# EAGLE design AltimeterFio (EAGLE 9.6.2)

## Sheet 1 of 2
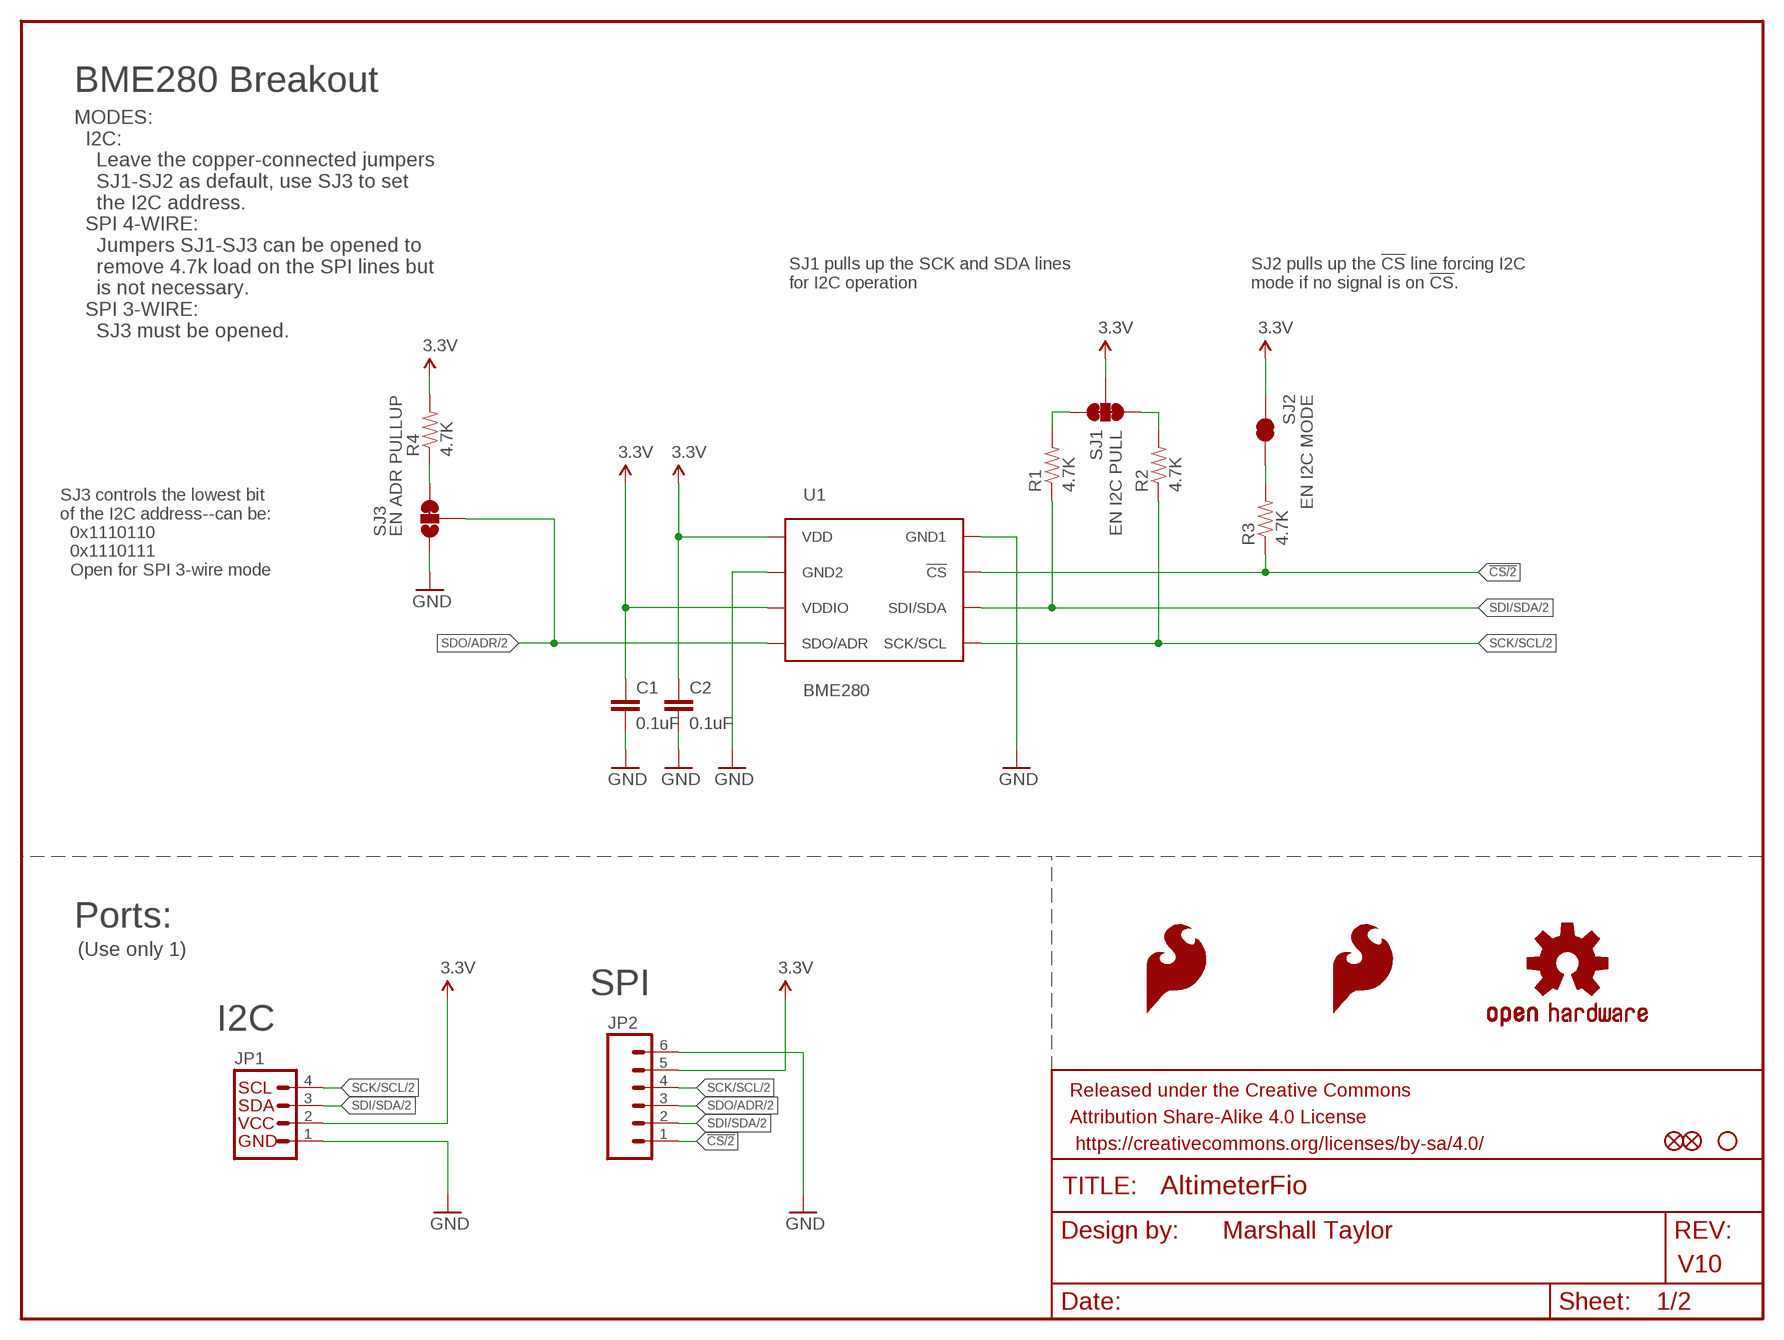
[diagram p0: schematic, sheet 1]

### Parts
C1  0.1uF  0.1UF-25V-5%(0603)  [0603-CAP]
C2  0.1uF  0.1UF-25V-5%(0603)  [0603-CAP]
FID1  FIDUCIAL1X2  [FIDUCIAL-1X2]
FID2  FIDUCIAL1X2  [FIDUCIAL-1X2]
FRAME1  FRAME-LETTER  [CREATIVE_COMMONS]
JP1  I2C_STANDARD_NO_SILK  [1X04_NO_SILK]
JP2  M06NO_SILK_FEMALE_PTH  [1X06_NO_SILK]
LOGO1  SFE_LOGO_FLAME.1_INCH  [SFE_LOGO_FLAME_.1]
LOGO2  SFE_LOGO_FLAME.1_INCH  [SFE_LOGO_FLAME_.1]
LOGO3  OSHW-LOGOS  [OSHW-LOGO-S]
R1  4.7K  4.7KOHM-1/10W-1%(0603)  [0603-RES]
R2  4.7K  4.7KOHM-1/10W-1%(0603)  [0603-RES]
R3  4.7K  4.7KOHM-1/10W-1%(0603)  [0603-RES]
R4  4.7K  4.7KOHM-1/10W-1%(0603)  [0603-RES]
SJ1  EN I2C PULL  JUMPER-PAD-3-NC_BY_TRACE  [PAD-JUMPER-3-3OF3_NC_BY_TRACE_YES_SILK_FULL_BOX]
SJ2  EN I2C MODE  JUMPER-PAD-2-NC_BY_TRACE  [PAD-JUMPER-2-NC_BY_TRACE_YES_SILK]
SJ3  EN ADR PULLUP  JUMPER-PAD-3-2OF3_NC_BY_TRACE_SMALL  [PAD-JUMPER-3-2OF3_NC_BY_TRACE_YES_SILK_FULL_BOX]
STANDOFF4  STAND-OFF  [STAND-OFF]
U1  BME280  [BME280_LGA]

### Nets
3.3V: C1.1 C2.1 JP1.2 JP2.5 R4.2 SJ1.2 SJ2.2 U1.P$6(VDDIO) U1.P$8(VDD) ; also sheet 2
!CS: JP2.1 R3.1 U1.P$2(!CS) ; also sheet 2
GND: C1.2 C2.2 JP1.1 JP2.6 SJ3.1 U1.P$1(GND1) U1.P$7(GND2) ; also sheet 2
N$1: R1.2 SJ1.3
N$2: R2.2 SJ1.1
N$3: R3.2 SJ2.1
N$4: R4.1 SJ3.3
SCK/SCL: JP1.4 JP2.4 R2.1 U1.P$4(SCK/SCL) ; also sheet 2
SDI/SDA: JP1.3 JP2.2 R1.1 U1.P$3(SDI/SDA) ; also sheet 2
SDO/ADR: JP2.3 SJ3.2 U1.P$5(SDO/ADR) ; also sheet 2

### Notes on the sheet
- BME280 Breakout
- MODES:
    I2C:
      Leave the copper-connected jumpers
      SJ1-SJ2 as default, use SJ3 to set
      the I2C address.
    SPI 4-WIRE:
      Jumpers SJ1-SJ3 can be opened to 
      remove 4.7k load on the SPI lines but
      is not necessary.
    SPI 3-WIRE:
      SJ3 must be opened.
- SJ1 pulls up the SCK and SDA lines
  for I2C operation
- SJ2 pulls up the !CS! line forcing I2C
  mode if no signal is on !CS!.
- SJ3 controls the lowest bit
  of the I2C address--can be:
    0x1110110
    0x1110111
    Open for SPI 3-wire mode
- Ports:
- (Use only 1)
- SPI
- I2C
- Marshall Taylor
- V10

## Sheet 2 of 2
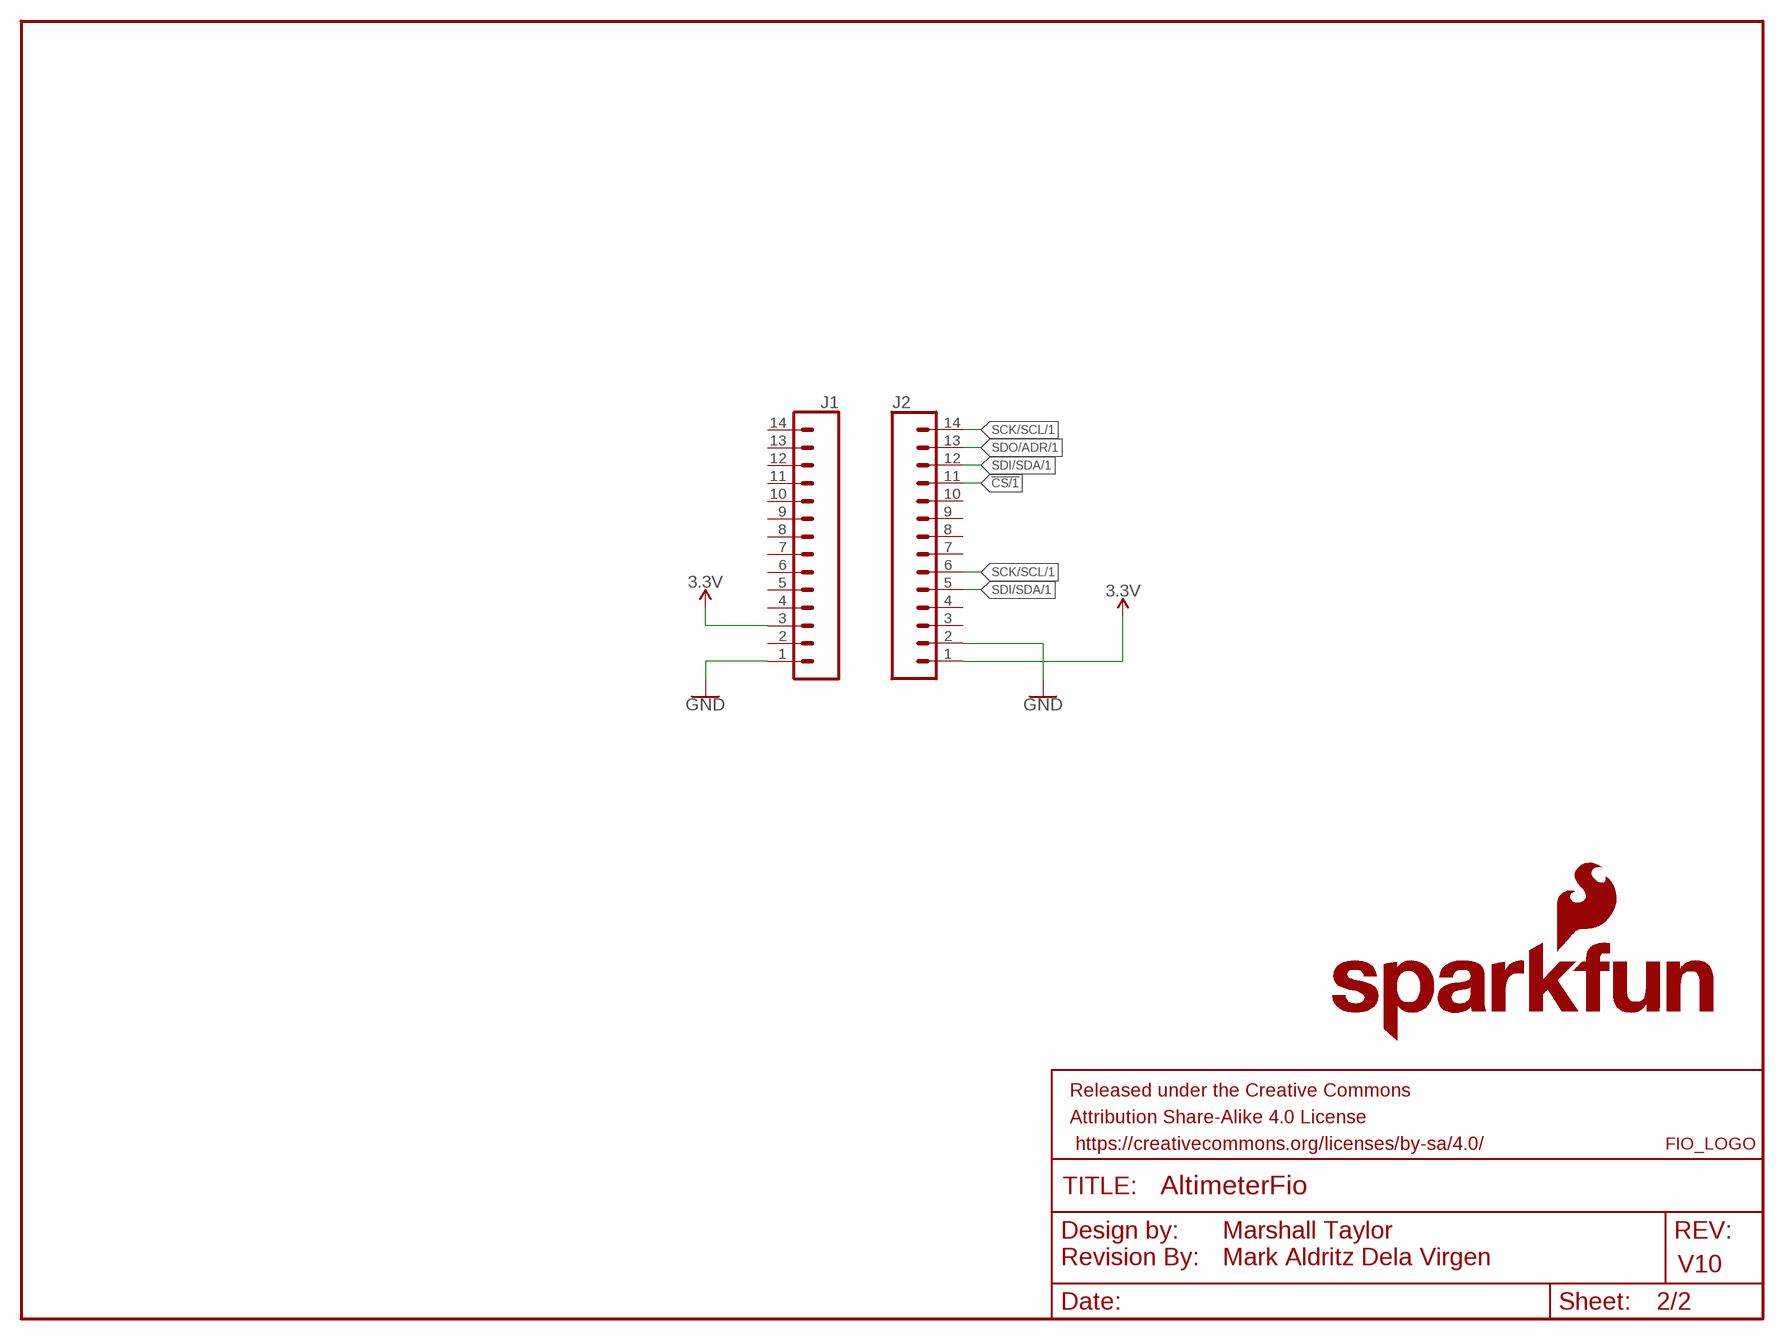
[diagram p1: schematic, sheet 2]

### Parts
FRAME2  FRAME-LETTERNO_PACKAGE  [DUMMY]
J1  CONN_14  [1X14]
J2  CONN_14  [1X14]
LOGO4  FIO_LOGOV2  [FIO_LOGO]
LOGO5  REVISION  [REVISION]
LOGO6  SFE_LOGO_NAME_FLAME.1_INCH  [SFE_LOGO_NAME_FLAME_.1]

### Nets
3.3V: J1.3 J2.1 ; also sheet 1
!CS: J2.11 ; also sheet 1
GND: J1.1 J2.2 ; also sheet 1
SCK/SCL: J2.6 J2.14 ; also sheet 1
SDI/SDA: J2.5 J2.12 ; also sheet 1
SDO/ADR: J2.13 ; also sheet 1
Unconnected: J1.2 J1.4 J1.5 J1.6 J1.7 J1.8 J1.9 J1.10 J1.11 J1.12 J1.13 J1.14 J2.3 J2.4 J2.7 J2.8 J2.9 J2.10

### Notes on the sheet
- Marshall Taylor
- Mark Aldritz Dela Virgen
- V10

## Library data of the parts
C1 C2 = SparkFun-Capacitors:0.1UF-25V-5%(0603): CAP-08604; PROD_ID: CAP-08604
FID1 FID2 = SparkFun-Aesthetics:FIDUCIAL: Fiducial Alignment Points Various fiducial points for machine vision alignment.
FRAME1 = SparkFun-Aesthetics:FRAME-LETTER: Schematic Frame Standard 8.5x11 US Letter frame
FRAME2 = SparkFun-Aesthetics:FRAME-LETTER: Schematic Frame - Letter Standard 8.5x11 US Letter frame; DESIGNER: Nobody; VERSION: v01
J1 J2 = SparkFun-Connectors:CONN_14: Multi connection point. Often used as Generic Header-pin footprint for 0.1 inch spaced/style header connections On any of the 0.1 inch spaced packages, you can populate with these: Break Away Headers - Straight <https://www.sparkfun.com/products/116> (PRT-00116) Break Away Male Headers - Right Angle <https://www.sparkfun.com/products/553> (PRT-00553) Female Headers <https://www.sparkfun.com/products/115> (PRT-00115) Break Away Headers - Machine Pin <https://www.sparkfun.com/products/117> (PRT-00117) Break Away Female Headers - Swiss Machine Pin <https://www.sparkfun.com/products/743> (PRT-00743) For SCREWTERMINALS and SPRING TERMINALS visit here: Screw Terimnals on SparkFun.com <https://www.sparkfun.com/search/results?term=Screw+Terminals> (5mm/3.5mm/2.54mm spacing) This device is also useful as a general connection point to wire up your design to another part of your project. Our various solder wires solder well into these plated through hole pads. Hook-Up Wire - Assortment (Stranded, 22 AWG) <https://www.sparkfun.com/products/11375> (PRT-11375) Hook-Up Wire - Assortment (Solid Core, 22 AWG) <https://www.sparkfun.com/products/11367> (PRT-11367) View the entire wire category on our website here <https://www.sparkfun.com/categories/141> Special notes: Molex polarized connector foot print use with SKU : PRT-08231 with associated crimp pins and housings. 1MM SMD Version SKU: PRT-10208 NOTES ON THE VARIANTS LOCK and LOCK_LONGPADS... This footprint was designed to help hold the alignment of a through-hole component (i.e. 6-pin header) while soldering it into place. You may notice that each hole has been shifted either up or down by 0.005 of an inch from it's more standard position (which is a perfectly straight line). This slight alteration caused the pins (the squares in the middle) to touch the edges of the holes. Because they are alternating, it causes a "brace" to hold the component in place. 0.005 has proven to be the perfect amount of "off-center" position when using our standard breakaway headers. Although looks a little odd when you look at the bare footprint, once you have a header in there, the alteration is very hard to notice. Also,if you push a header all the way into place, it is covered up entirely on the bottom side.
JP1 = SparkFun-Connectors:I2C_STANDARD: SparkFun has standardized on a pinout for all I2C based sensor breakouts. This pinout allows I2C boards to be plugged directly into the headers on Arduino Uno compatible boards, and to be daisy chained easily.
JP2 = SparkFun-Connectors:M06: Header 6 Standard 6-pin 0.1" header. Use with straight break away headers (SKU : PRT-00116), right angle break away headers (PRT-00553), swiss pins (PRT-00743), machine pins (PRT-00117), and female headers (PRT-00115). Molex polarized connector foot print use with SKU : PRT-08094 with associated crimp pins and housings. NOTES ON THE VARIANTS LOCK and LOCK_LONGPADS... This footprint was designed to help hold the alignment of a through-hole component (i.e. 6-pin header) while soldering it into place. You may notice that each hole has been shifted either up or down by 0.005 of an inch from it's more standard position (which is a perfectly straight line). This slight alteration caused the pins (the squares in the middle) to touch the edges of the holes. Because they are alternating, it causes a "brace" to hold the component in place. 0.005 has proven to be the perfect amount of "off-center" position when using our standard breakaway headers. Although looks a little odd when you look at the bare footprint, once you have a header in there, the alteration is very hard to notice. Also,if you push a header all the way into place, it is covered up entirely on the bottom side. This idea of altering the position of holes to aid alignment will be further integrated into the Sparkfun Library for other footprints. It can help hold any component with 3 or more connection pins.; PROD_ID: CONN-08437
LOGO1 LOGO2 = SparkFun-Aesthetics:SFE_LOGO_FLAME: SFE Logo, flame only This is the SparkFun flame logo. The logo on the schematic will always be the same size; the package variant is the height of the flame. Default layer for the logo on the board is tSilk.
LOGO3 = SparkFun-Aesthetics:OSHW-LOGO: Open Source Hardware Logo This logo indicates the piece of hardware it is found on incorporates a OSHW license and/or adheres to the definition of open source hardware found here: http://freedomdefined.org/OSHW
LOGO4 = SparkFun-Aesthetics:FIO_LOGO: Funnel IO (FIO) Logo - Silkscreen Used on the Arduino Fio <https://www.sparkfun.com/products/10116>. Devices using: FIO_LOGO
LOGO5 = SparkFun-Aesthetics:REVISION: "Revision By" Text Preceding text for revisor documentation. Includes schematic text on "symbols" layer, and board text on tDoc.
LOGO6 = SparkFun-Aesthetics:SFE_LOGO_NAME_FLAME: SparkFun Font Logo w/ Flame This is the SparkFun full logo. The logo on the schematic will always be the same size; the package variant is the height of the flame part of the logo. Default layer for the logo on the board is tSilk.
R1-R4 = SparkFun-Resistors:4.7KOHM-1/10W-1%(0603): RES-07857; PROD_ID: RES-07857
SJ1 = SparkFun-Passives:JUMPER-PAD-3-NC_BY_TRACE
SJ2 = SparkFun-Passives:JUMPER-PAD-2-NC_BY_TRACE
SJ3 = SparkFun-Passives:JUMPER-PAD-3-2OF3_NC_BY_TRACE
STANDOFF4 = SparkFun-Electromechanical:STAND-OFF: #4 Stand Off This is the mechanical footprint for a #4 phillips button head screw. Use the keepout ring to avoid running the screw head into surrounding components. SKU : PRT-00447
U1 = BME280ComponentLibrary:BME280; PROD_ID: IC-13090

## Board
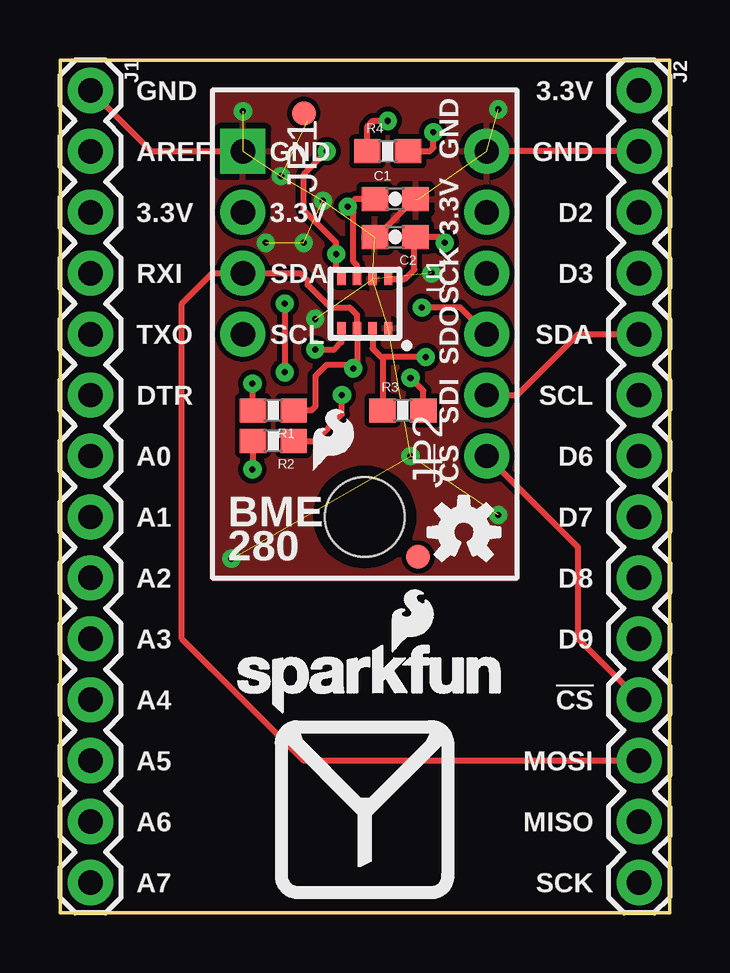
[diagram p2: board, top side]
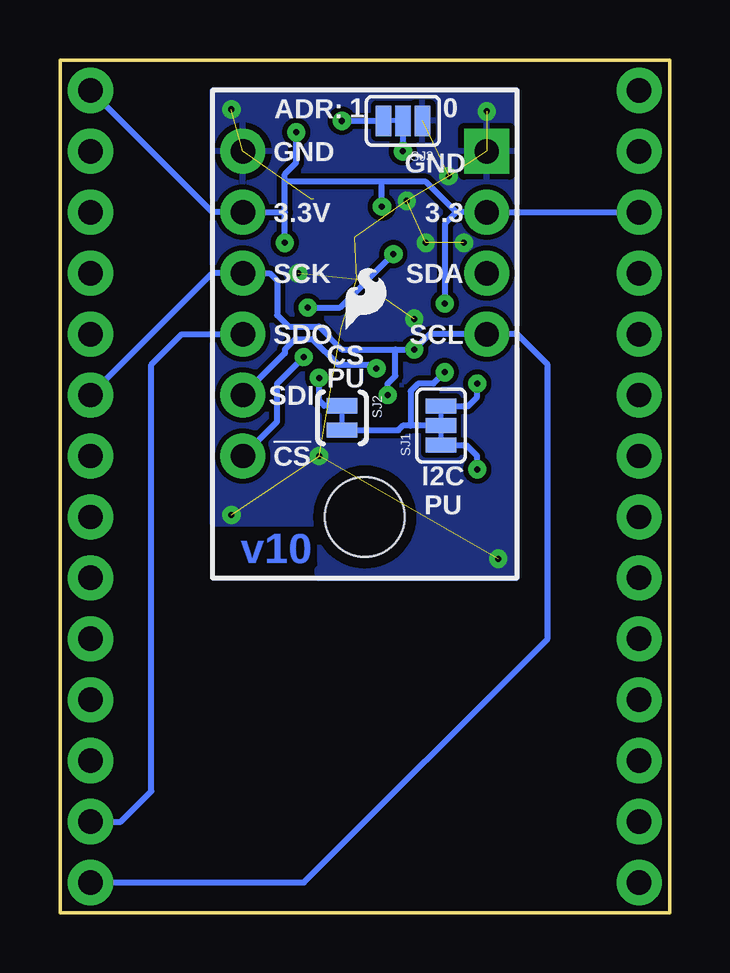
[diagram p3: board, bottom side, seen from below]

Size 25.4 x 35.56 mm. Coordinates in mm from the lower left corner, seen from the top.
Outline: 0,35.56 25.4,35.56 25.4,0 0,0 0,35.56
Copper layers (1*16): Top 0.035mm / dielectric 1.5mm / Bottom 0.035mm
Design rules "SparkFun-2-layer": minimum track width 7mil, minimum drill 15mil, track to track 8mil, track to pad 8mil, pad to pad 8mil, via to via 8mil, smd to smd 8mil, copper to edge 8mil, drill to drill 8mil, minimum pad ring 12mil, minimum via ring 10mil, stop-mask expansion 4mil, vias tented up to drill 20mil, thermal gap 10mil

### Footprints (pad centres in the part's own frame; a part is rotated, then mirrored left to right if it is on the bottom)
0603-CAP = smd 1.1 x 1: 1 -0.85,0; 2 0.85,0
FIDUCIAL-1X2 = smd 1 x 1: 1 0,0
1X14 = drill 1.016 pad 1.88: 1 0,0; 2 2.54,0; 3 5.08,0; 4 7.62,0; 5 10.16,0; 6 12.7,0; 7 15.24,0; 8 17.78,0; 9 20.32,0; 10 22.86,0; 11 25.4,0; 12 27.94,0; 13 30.48,0; 14 33.02,0
1X04_NO_SILK = drill 1.016 pad 1.88 square: 1 0,0 | drill 1.016 pad 1.88: 2 2.54,0; 3 5.08,0; 4 7.62,0
1X06_NO_SILK = drill 1.016 pad 1.88: 1 0,0; 2 2.54,0; 3 5.08,0; 4 7.62,0; 5 10.16,0; 6 12.7,0
0603-RES = smd 1.1 x 1: 1 -0.85,0; 2 0.85,0
PAD-JUMPER-3-3OF3_NC_BY_TRACE_YES_SILK_FULL_BOX = smd 0.635 x 1.27: 1 -0.813,0; 2 0,0; 3 0.813,0
PAD-JUMPER-2-NC_BY_TRACE_YES_SILK = smd 0.635 x 1.27: 1 -0.508,0; 2 0.508,0
PAD-JUMPER-3-2OF3_NC_BY_TRACE_YES_SILK_FULL_BOX = smd 0.635 x 1.27: 1 -0.813,0; 2 0,0; 3 0.813,0
STAND-OFF = hole 3.302: 0,0
BME280_LGA = smd 0.5 x 0.35: P$1 1.025,0.975; P$2 1.025,0.325; P$3 1.025,-0.325; P$4 1.025,-0.975; P$5 -1.025,-0.975; P$6 -1.025,-0.325; P$7 -1.025,0.325; P$8 -1.025,0.975

### Placement (x,y rotation side)
C1  13.97,29.77 0 top
C2  13.97,28.18 180 top
FID1  10.16,33.34 0 top
FID2  14.92,14.84 0 top
FRAME1  -26.67,-22.86 0 top  (outside the outline)
FRAME2  -26.67,-25.4 0 top  (outside the outline)
J1  1.27,34.29 270 top
J2  24.13,34.29 270 top
JP1  7.62,31.75 270 top
JP2  17.78,19.05 90 top
LOGO1  13.81,23.97 0 bottom
LOGO2  10.24,18.1 0 top
LOGO3  16.83,15.88 0 top
LOGO4  12.7,4.29 0 bottom
LOGO5  -15.24,-25.4 0 top  (outside the outline)
LOGO6  6.99,8.26 0 top
R1  8.89,20.95 180 top
R2  8.89,19.68 180 top
R3  14.29,20.95 0 top
R4  13.65,31.75 0 top
SJ1  9.53,20.32 90 bottom
SJ2  13.65,20.64 270 bottom
SJ3  11.11,33.02 180 bottom
STANDOFF4  12.7,16.51 0 top
U1  12.7,25.4 270 top

### Tracks (layer width: path | path; a pad name or v marks a point on that pad's centre or on a via)
3.3V  (via drill 0.25)
  Top 0.254: U1.P$6 12.38,27 12.22,27.15 12.22,29.21 v11.99,29.45 12.3,29.77 C1.1 | U1.P$8 14.36,26.43 14.76,26.83 14.76,28.12 C2.1 15.8,28.18 v16.03,27.94 | v9.37,25.4 v9.37,22.54 | R4.2 15.4,31.75 15.56,31.91 v15.56,32.54
  Bottom 0.254: 8.89,29.21 JP1.2 J1.3 | 8.89,29.21 10.16,30.48 11.99,30.48 | 11.99,30.48 16.03,30.48 | v16.03,27.94 16.03,29.21 | 16.03,29.21 16.03,30.48 | 16.03,30.48 16.03,30.8 15.56,31.27 v15.56,32.54 | v11.99,29.45 11.99,30.48 | 8.89,29.21 9.37,28.73 v9.37,25.4 | SJ1.2 10.79,20.32 | 10.79,20.32 11.11,20.32 11.3,20.13 SJ2.2 | v9.37,22.54 9.84,22.07 10.48,22.07 10.79,21.75 10.79,20.32 | 16.03,29.21 JP2.5 19.05,29.21 J2.1
!CS  (via drill 0.25)
  Top 0.254: v15.24,23.18 13.38,23.18 | U1.P$2 13.03,23.53 13.38,23.18 | 13.38,23.18 13.44,23.12 R3.1 | J2.11 21.59,11.43 21.59,15.24 JP2.1
  Bottom 0.254: JP2.1 16.35,20.48 16.35,22.07 v15.24,23.18
GND  (via drill 0.25)  (17 unrouted)
  Top 0.254: C2.2 13.18,28.18 14.76,29.77 14.92,29.77 | J1.1 3.81,31.75 JP1.1 | J2.2 JP2.6
  other vias: 15.48,26.67 8.57,27.94 14.61,19.05 10.64,24.77 18.26,33.5 9.21,30.72 7.62,33.42 10.16,27.94 10.95,29.69 7.14,14.76 18.26,16.59
  pour Top (isolate 0.203): 6.35,13.97 19.05,13.97 19.05,34.29 6.35,34.29
  pour Bottom (isolate 0.203): 6.35,34.29 19.05,34.29 19.05,16.23 14.68,16.23 14.68,13.97 6.35,13.97
N$1  (via drill 0.25)
  Top 0.254: v8.02,22.07 8.02,20.98 R1.2
  Bottom 0.254: SJ1.3 8.39,21.13 8.02,21.51 v8.02,22.07
N$2  (via drill 0.25)
  Top 0.254: R2.2 8.04,18.52 v8.02,18.49
  Bottom 0.254: SJ1.1 8.47,19.51 8.02,19.05 v8.02,18.49
N$3  (via drill 0.25)
  Top 0.254: R3.2 15.14,21.77 v14.61,22.3
  Bottom 0.254: SJ2.1 14.4,21.14 14.61,21.35 v14.61,22.3
N$4  (via drill 0.25)
  Top 0.254: R4.1 12.8,32.8 13.02,33.02 v13.65,33.02
  Bottom 0.254: v13.65,33.02 SJ3.3
SCK/SCL  (via drill 0.25)
  Top 0.254: v10.64,23.5 11.43,23.5 11.72,23.79 U1.P$4 | R2.1 10.64,19.68 11.75,20.8 v11.75,21.59
  Bottom 0.254: 11.43,23.5 13.65,23.5 14.61,24.45 15.88,24.45 16.35,24.92 16.35,26.35 16.67,26.67 JP2.4 19.05,26.67 J2.6 | 11.43,23.5 v10.64,23.5 10,24.13 JP1.4 6.35,24.13 5.08,22.86 5.08,11.43 15.24,1.27 J2.14 | v11.75,21.59 11.75,22.07 11.43,22.38 11.43,23.5
SDI/SDA  (via drill 0.25)
  Top 0.254: R1.1 10.48,20.95 10.64,21.11 10.64,22.38 11.11,22.86 12.06,22.86 v12.22,22.7 12.38,22.86 U1.P$3 12.38,24.93 12.06,25.24 11.27,25.24 10.32,26.19 10.32,26.35 10,26.67 JP1.3 6.35,26.67 5.08,25.4 5.08,11.43 10.16,6.35 J2.12 | JP2.2 19.05,21.59 21.59,24.13 J2.5
  Bottom 0.254: v12.22,22.7 12.38,22.86 13.81,22.86 14.88,23.93 15.6,23.93 16.03,23.5 16.03,23.34 JP2.2
SDO/ADR  (via drill 0.25)
  Top 0.254: U1.P$5 11.72,26.69 11.51,26.91 v11.51,27.46 11.51,27.94 10.16,29.29 10.16,30.8 v11.11,31.75 | JP2.3 16.67,25.24 v15.08,25.24
  Bottom 0.254: v15.08,25.24 13.73,25.24 v11.51,27.46 | SJ3.2 11.27,32.86 11.11,32.7 v11.11,31.75 | J2.13 22.86,3.81 21.59,5.08 21.59,22.86 20.32,24.13 JP2.3

### Text on the board
Bottom: v10
tPlace: GND | 3.3V | AREF | GND | GND | GND | 3.3V | 3.3V | D2 | 3.3V | SCK | RXI | SDA | D3 | TXO | SCL | SDA | SDO | DTR | SDI | SCL | !CS | A0 | D6 | A1 | D7 | BME / 280 | A2 | D8 | A3 | D9 | A4 | !CS | A5 | MOSI | A6 | MISO | A7 | SCK
bPlace: 0 | 1 | ADR: | GND | GND | 3.3 | 3.3V | SDA | SCK | SCL | SDO | CS / PU | SDI | !CS | I2C / PU
tDocu: Marshall Taylor | Mark Aldritz Dela Virgen | Note: Top and bottom ground planes must be isolated / no more than 0.008 inch to allow proper grounding.